# EAGLE design compact (EAGLE 7.2.0)
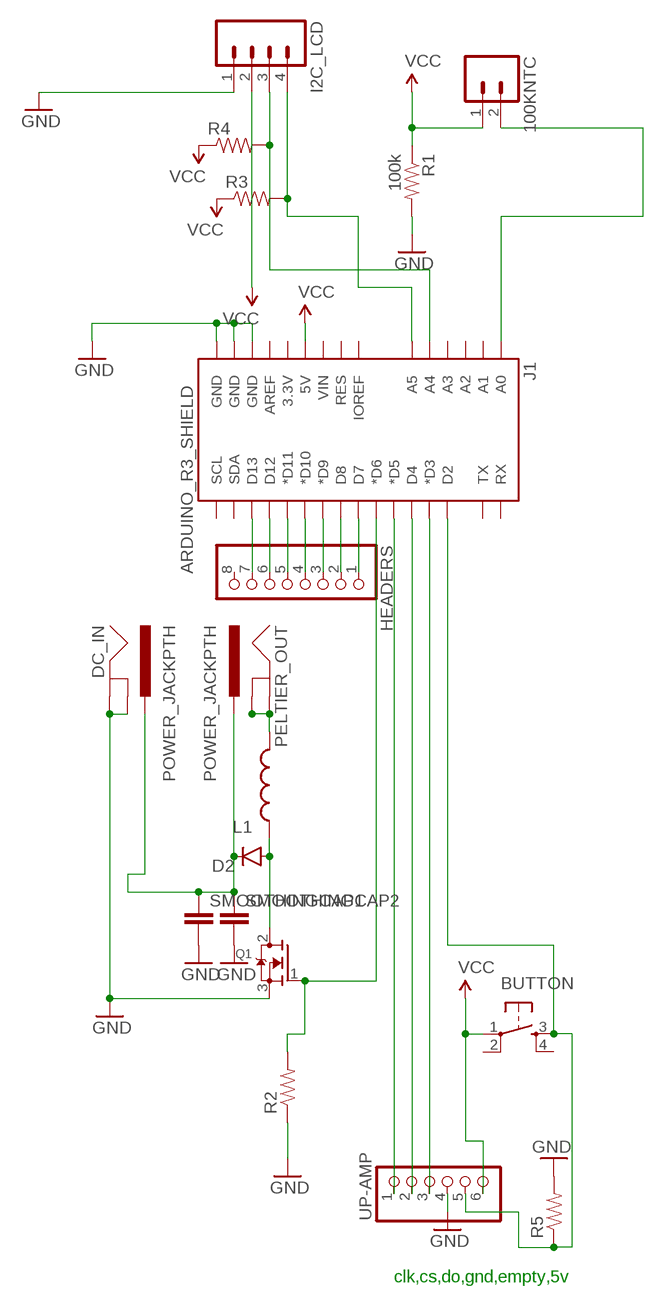
[diagram p0: schematic, sheet 1]

## Parts
100KNTC  M02LOCK  [1X02_LOCK]
BUTTON  TAC_SWITCHPTH  [TACTILE-PTH]
D2  DIODEPTH  [DIODE-1N4001]
DC_IN  POWER_JACKPTH  [POWER_JACK_PTH]
HEADERS  PINHD-1X8BIG  [1X08-BIG]
I2C_LCD  M04JST  [1X04-1.5MM_JST]
J1  ARDUINO_R3_SHIELD  [UNO_R3_SHIELD]
L1  INDUCTORRLB0912  [RLB0912]
PELTIER_OUT  POWER_JACKPTH  [POWER_JACK_PTH]
Q1  MOSFET-NGDS_TO220V  [TO220V]
R1  100k  RESISTORPTH-1/4W  [AXIAL-0.4]
R2  RESISTORPTH-1/4W  [AXIAL-0.4]
R3  RESISTORPTH-1/4W  [AXIAL-0.4]
R4  RESISTORPTH-1/4W  [AXIAL-0.4]
R5  RESISTORPTH-1/4W  [AXIAL-0.4]
SMOOTHINGCAP1  CAPPTH3  [CAP-PTH-LARGE]
SMOOTHINGCAP2  CAPPTH3  [CAP-PTH-LARGE]
UP-AMP  PINHD-1X6  [1X06]

## Nets
GND: DC_IN.GND DC_IN.GNDBREAK I2C_LCD.1 J1.GND@0(GND) J1.GND@1(GND) J1.GND@2(GND) Q1.3(S) R1.P$2 R2.P$1 R5.P$2 SMOOTHINGCAP1.2 SMOOTHINGCAP2.2 UP-AMP.4
N$1: D2.C DC_IN.PWR PELTIER_OUT.PWR SMOOTHINGCAP1.1 SMOOTHINGCAP2.1
N$2: I2C_LCD.3 J1.A4 R4.P$2
N$3: J1.D6(*D6) Q1.1(G) R2.P$2
N$4: J1.D5(*D5) UP-AMP.1
N$5: J1.D4 UP-AMP.2
N$6: J1.D3(*D3) UP-AMP.3
N$7: D2.A L1.1 Q1.2(D)
N$8: I2C_LCD.4 J1.A5 R3.P$2
N$9: BUTTON.3 J1.D2 R5.P$1 UP-AMP.5
N$10: 100KNTC.2 J1.A0
N$11: HEADERS.1 J1.D7
N$12: HEADERS.2 J1.D8
N$13: HEADERS.3 J1.D9(*D9)
N$14: HEADERS.4 J1.D10(*D10)
N$15: HEADERS.5 J1.D11(*D11)
N$16: HEADERS.6 J1.D12
N$17: HEADERS.7 J1.D13
N$18: L1.2 PELTIER_OUT.GND PELTIER_OUT.GNDBREAK
VCC: 100KNTC.1 BUTTON.1 I2C_LCD.2 J1.5V R1.P$1 R3.P$1 R4.P$1 UP-AMP.6
Unconnected: BUTTON.2 BUTTON.4 HEADERS.8 J1.3.3V J1.A1 J1.A2 J1.A3 J1.AREF J1.IOREF J1.RES J1.RX J1.SCL J1.SDA J1.TX J1.VIN

## Notes on the sheet
- clk,cs,do,gnd,empty,5v

## Library data of the parts
100KNTC = SparkFun-Connectors:M02: Standard 2-pin 0.1" header. Use with - straight break away headers ( PRT-00116) - right angle break away headers (PRT-00553) - swiss pins (PRT-00743) - machine pins (PRT-00117) - female headers (PRT-00115) Molex polarized connector foot print use with: PRT-08233 with associated crimp pins and housings. 2.54_SCREWTERM for use with PRT-10571. 3.5mm Screw Terminal footprints for PRT-08084 5mm Screw Terminal footprints for use with PRT-08432
BUTTON = SparkFun-Retired:TAC_SWITCH: Momentary Switch Button commonly used for reset or general input. Spark Fun Electronics SKU : COM-00097 SMT- SWCH-08247
D2 = SparkFun-DiscreteSemi:DIODE: Diode These are standard reverse protection diodes and small signal diodes. SMA package can handle up to about 1A. SOD-323 can handle about 200mA. What the SOD-323 package when ordering, there are some mfgs out there that are 5-pin packages.
DC_IN PELTIER_OUT = SparkFun-Connectors:POWER_JACK: Power Jack This is the standard 5.5mm barrel jack for power. The PTH is the most common, proven, reliable, footprint. The Slot footprint only works if the mill layer is transmitted to the PCB fab house so be warned. Mating wall wart : TOL-00298 (and others); PROD_ID: CONN-08197
HEADERS = adafruit:PINHD-1X8: PIN HEADER
I2C_LCD = SparkFun-Connectors:M04: Header 4 Standard 4-pin 0.1" header. Use with straight break away headers (SKU : PRT-00116), right angle break away headers (PRT-00553), swiss pins (PRT-00743), machine pins (PRT-00117), and female headers (PRT-00115). Molex polarized connector foot print use with SKU : PRT-08231 with associated crimp pins and housings. 1MM SMD Version SKU: PRT-10208
J1 = SparkFun-Boards:ARDUINO_R3_SHIELD: Shield form compatible with the Arduino Uno R3.
L1 = SparkFun-Passives:INDUCTOR: Inductors Basic Inductor/Choke - 0603 and 1206. Footprints are not proven and vary greatly between part numbers. SRN6045- 33uH, 20% 1.4A SDR0403-560KL - 56uH, 10%, 500mA RMS/740mA peak
Q1 = adafruit:MOSFET-N: N-Channel Mosfet 2N7002E - 60V 260mA SOT23 [Digikey: 2N7002ET1GOSTR-ND] - REEL BSH103 - 30V 850mA SOT23 [Digikey: 568-5013-1-ND]
R1 R2 R5 = SparkFun-Passives:RESISTOR: Resistor Basic schematic elements and footprints for 0603, 1206, and PTH resistors.
R3 R4 = SparkFun-Resistors:RESISTOR: Resistor Basic schematic elements and footprints for 0603, 1206, and PTH resistors.
SMOOTHINGCAP1 SMOOTHINGCAP2 = SparkFun-Capacitors:CAP: Capacitor Standard 0603 ceramic capacitor, and 0.1" leaded capacitor.
UP-AMP = adafruit:PINHD-1X6: PIN HEADER

## Board
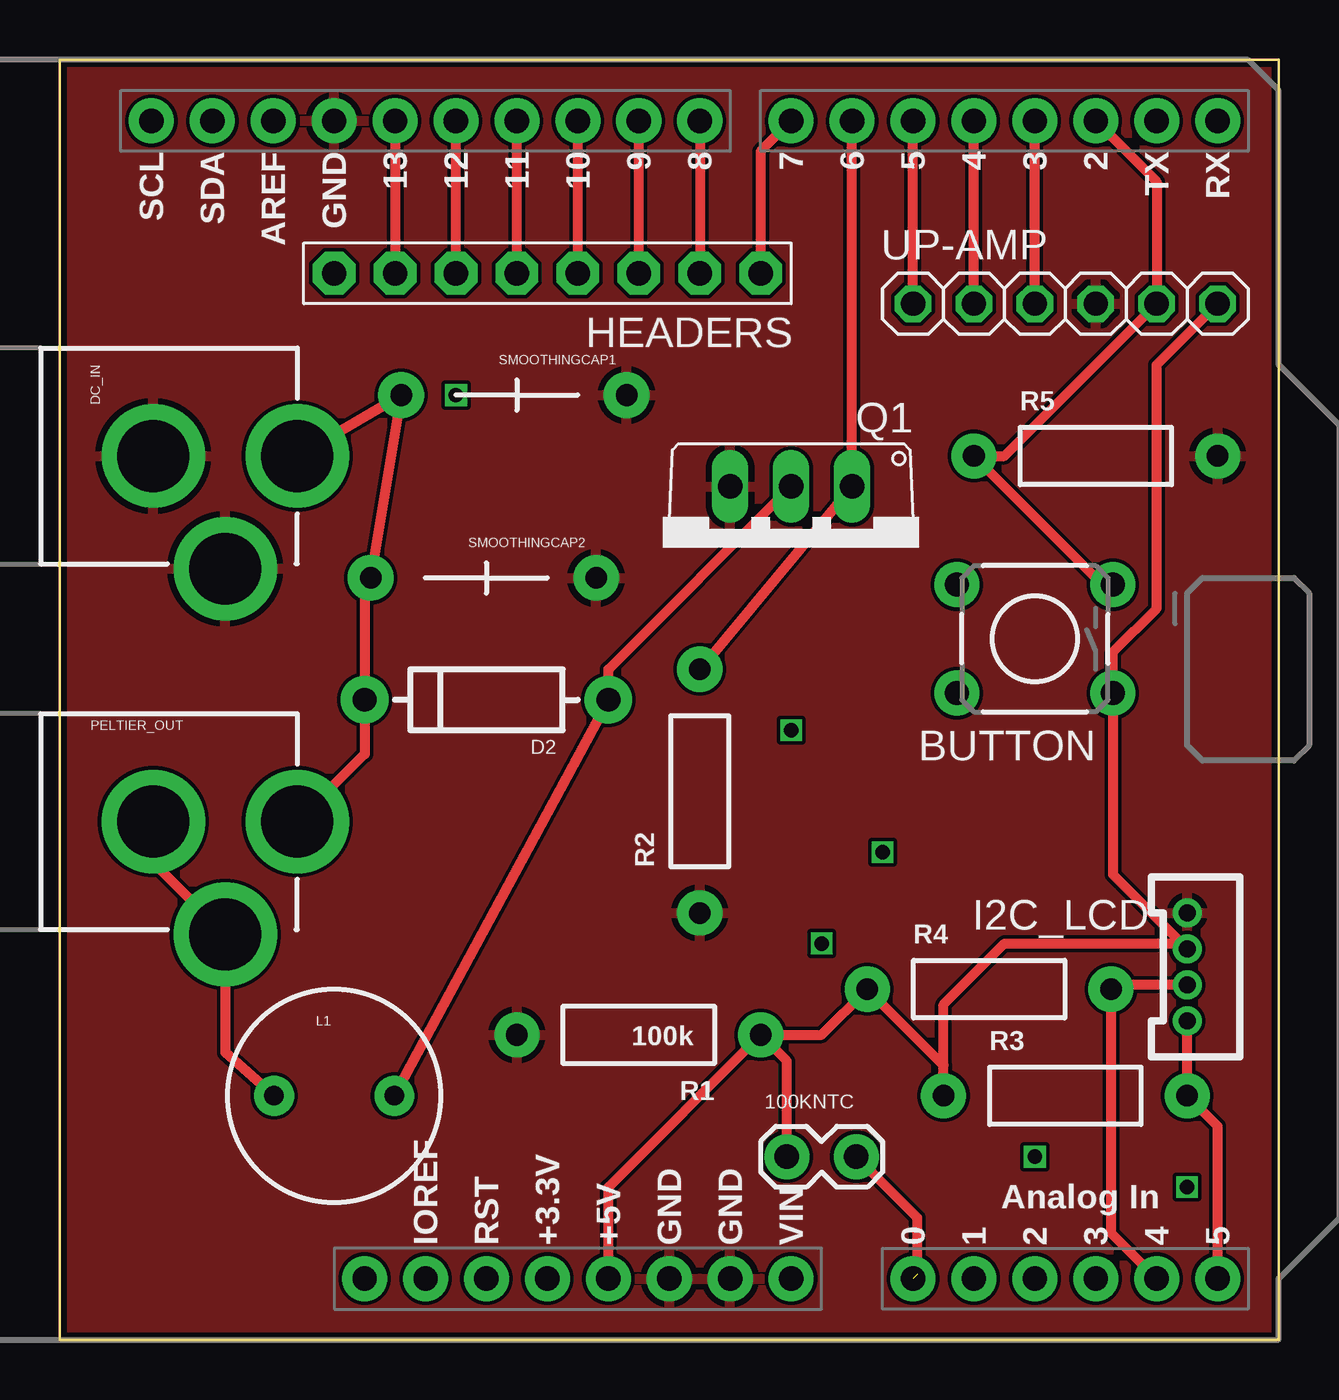
[diagram p1: board, top side]
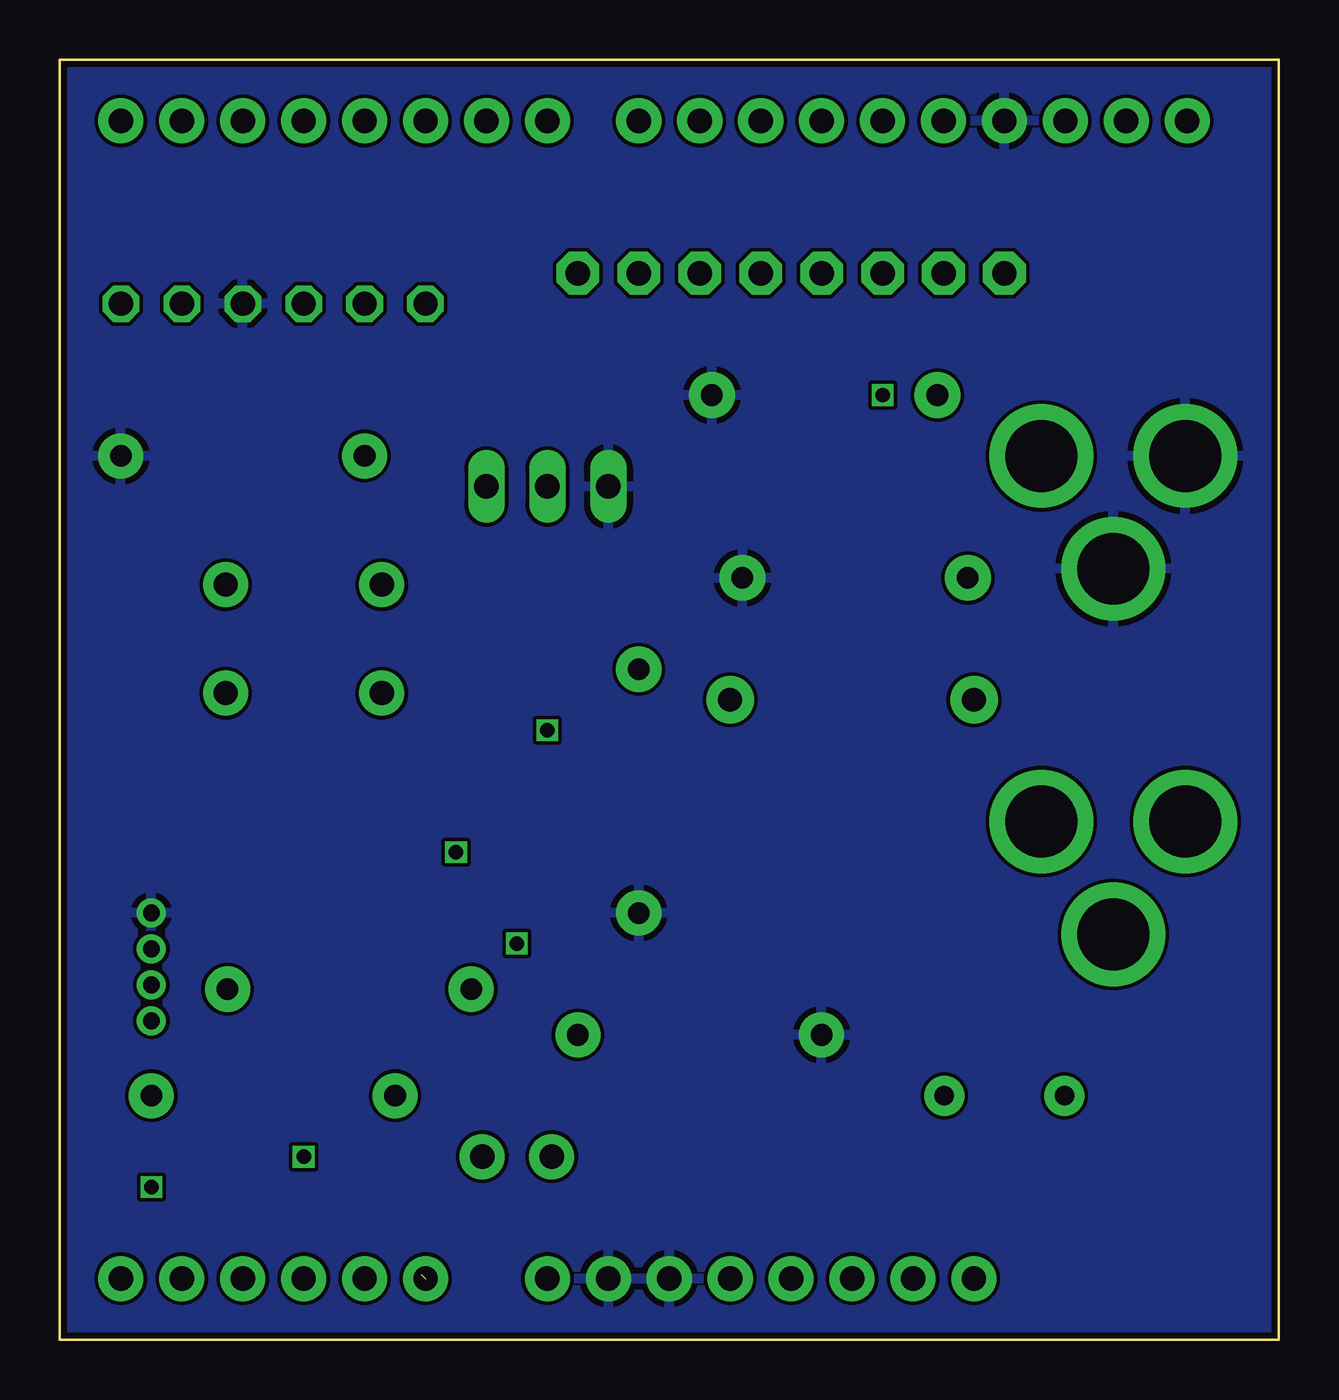
[diagram p2: board, bottom side, seen from below]

Size 50.8 x 53.34 mm. Coordinates in mm from the lower left corner, seen from the top.
Outline: 0,53.34 50.8,53.34 50.8,0 0,0 0,53.34
Copper layers (1*16): Top 0.035mm / dielectric 1.5mm / Bottom 0.035mm
Design rules "SeeedStudio_2layer_DRU_no_angle_20140221": minimum track width 6mil, minimum drill 12mil, track to track 6mil, track to pad 6mil, pad to pad 6mil, via to via 6mil, smd to smd 0mil, copper to edge 10mil, drill to drill 10mil, minimum pad ring 10mil, minimum via ring 6mil, stop-mask expansion 2mil, vias tented up to drill 100mil, thermal gap 10mil

### Footprints (pad centres in the part's own frame; a part is rotated, then mirrored left to right if it is on the bottom)
1X02_LOCK = drill 1.016 pad 1.88: 1 -0.178,0; 2 2.718,0
TACTILE-PTH = drill 1.016 pad 1.88: 1 -3.251,2.261; 2 3.251,2.261; 3 -3.251,-2.261; 4 3.251,-2.261
DIODE-1N4001 = drill 1 pad 1.981: A -5.08,0; C 5.08,0
POWER_JACK_PTH = drill 2.997 pad 4.318: GND 0,7.7; GNDBREAK 4.7,10.7; PWR 0,13.7
1X08-BIG = drill 1.016 pad 1.778 octagon: 1 -8.89,0; 2 -6.35,0; 3 -3.81,0; 4 -1.27,0; 5 1.27,0; 6 3.81,0; 7 6.35,0; 8 8.89,0
1X04-1.5MM_JST = drill 0.7: 1 0,0; 2 1.5,0; 3 3,0; 4 4.5,0
UNO_R3_SHIELD = drill 1.016 pad 1.88: 3.3V 50.8,26.67; 5V 50.8,29.21; A0 50.8,41.91; A1 50.8,44.45; A2 50.8,46.99; A3 50.8,49.53; A4 50.8,52.07; A5 50.8,54.61; AREF 2.54,15.24; D2 2.54,49.53; D3 2.54,46.99; D4 2.54,44.45; D5 2.54,41.91; D6 2.54,39.37; D7 2.54,36.83; D8 2.54,33.02; D9 2.54,30.48; D10 2.54,27.94; D11 2.54,25.4; D12 2.54,22.86; D13 2.54,20.32; GND@0 50.8,31.75; GND@1 50.8,34.29; GND@2 2.54,17.78; IOREF 50.8,21.59; NC 50.8,19.05; RES 50.8,24.13; RX 2.54,54.61; SCL 2.54,10.16; SDA 2.54,12.7; TX 2.54,52.07; VIN 50.8,36.83
RLB0912 = drill 0.813 pad 1.651: 1 2.502,0; 2 -2.502,0
TO220V = drill 1.016 long: 1 -2.54,-2.54; 2 0,-2.54; 3 2.54,-2.54
AXIAL-0.4 = drill 0.9 pad 1.88: P$1 -5.08,0; P$2 5.08,0
CAP-PTH-LARGE = drill 0.9 pad 1.905: 1 -4.826,0; 2 4.572,0
1X06 = drill 1.016 octagon: 1 -6.35,0; 2 -3.81,0; 3 -1.27,0; 4 1.27,0; 5 3.81,0; 6 6.35,0

### Placement (x,y rotation side)
100KNTC  30.48,7.62 0 top
BUTTON  40.64,29.21 180 top
D2  17.78,26.67 180 top
DC_IN  -3.81,36.83 270 top
HEADERS  20.32,44.45 180 top
I2C_LCD  46.99,17.78 270 top
J1  -6.35,53.34 270 top
L1  11.43,10.16 0 top
PELTIER_OUT  -3.81,21.59 270 top
Q1  30.48,33.02 180 top
R1  24.13,12.7 180 top
R2  26.67,22.86 90 top
R3  41.91,10.16 0 top
R4  38.74,14.6 0 top
R5  43.18,36.83 0 top
SMOOTHINGCAP1  19.05,39.37 0 top
SMOOTHINGCAP2  17.78,31.75 0 top
UP-AMP  41.91,43.18 0 top

### Tracks (layer width: path | path; a pad name or v marks a point on that pad's centre or on a via)
GND
  pour Top: 0,53.34 0,0 50.8,0 50.8,53.34
  pour Bottom: 0,53.34 50.8,53.34 50.8,0 0,0
N$1
  Top 0.406: DC_IN.PWR SMOOTHINGCAP1.1 SMOOTHINGCAP2.1 12.7,31.75 D2.C 12.7,24.4 PELTIER_OUT.PWR
N$2
  Top 0.406: I2C_LCD.3 43.99,14.78 R4.P$2 43.82,4.44 J1.A4
N$3
  Top 0.406: R2.P$2 Q1.1 J1.D6
N$4
  Top 0.406: UP-AMP.1 J1.D5
N$5
  Top 0.406: UP-AMP.2 J1.D4
N$6
  Top 0.406: UP-AMP.3 J1.D3
N$7
  Top 0.406: L1.1 D2.A 22.86,27.94 Q1.2
N$8
  Top 0.406: J1.A5 48.26,8.89 R3.P$2 I2C_LCD.4
N$9
  Top 0.406: J1.D2 45.72,48.26 UP-AMP.5 39.37,36.83 R5.P$1 43.46,31.47 BUTTON.3
N$10  (1 unrouted)
  Top 0.406: 35.74,2.72 35.74,5.08 100KNTC.2
N$11
  Top 0.406: J1.D7 29.21,49.53 HEADERS.1
N$12
  Top 0.406: J1.D8 HEADERS.2
N$13
  Top 0.406: HEADERS.3 J1.D9
N$14
  Top 0.406: HEADERS.4 J1.D10
N$15
  Top 0.406: HEADERS.5 J1.D11
N$16
  Top 0.406: HEADERS.6 J1.D12
N$17
  Top 0.406: J1.D13 HEADERS.7
N$18
  Top 0.406: PELTIER_OUT.GND 3.89,19.89 PELTIER_OUT.GNDBREAK 6.89,11.97 L1.2
N$19  (via drill 0.6)
  other vias: 16.51,39.37
N$21  (via drill 0.6)
  other vias: 30.48,25.4
N$22  (via drill 0.6)
  other vias: 34.29,20.32
N$23  (via drill 0.6)
  other vias: 40.64,7.62
N$24  (via drill 0.6)
  other vias: 46.99,6.35
N$25  (via drill 0.6)
  other vias: 31.75,16.51
VCC
  Top 0.406: J1.5V 22.86,6.35 R1.P$1 | R1.P$1 31.75,12.7 R4.P$1 36.83,11.43 R3.P$1 36.83,13.97 39.37,16.51 46.76,16.51 I2C_LCD.2 43.89,19.38 BUTTON.1 43.89,28.65 45.72,30.48 45.72,40.64 UP-AMP.6 | 100KNTC.1 30.3,11.61 R1.P$1